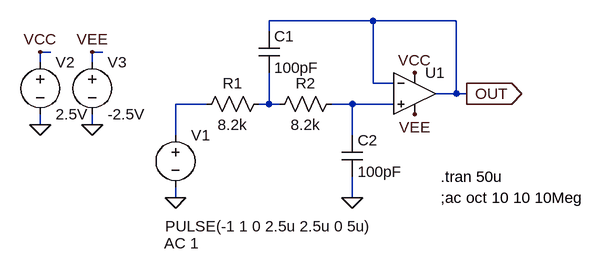
[diagram p0: schematic 2nd VCVS.asc]
2nd VCVS.asc, the LTspice schematic file:
Version 4
SHEET 1 880 680
WIRE 80 -16 -80 -16
WIRE 208 -16 80 -16
WIRE -80 0 -80 -16
WIRE -416 32 -432 32
WIRE -336 32 -352 32
WIRE -432 48 -432 32
WIRE -352 48 -352 32
WIRE 80 80 80 -16
WIRE 112 80 80 80
WIRE 208 96 208 -16
WIRE 208 96 176 96
WIRE 224 96 208 96
WIRE -176 112 -224 112
WIRE -80 112 -80 64
WIRE -80 112 -96 112
WIRE -64 112 -80 112
WIRE 48 112 16 112
WIRE 112 112 48 112
WIRE -432 144 -432 128
WIRE -352 144 -352 128
WIRE -224 160 -224 112
WIRE 48 160 48 112
WIRE -224 256 -224 240
WIRE 48 256 48 224
FLAG -224 256 0
FLAG 48 256 0
FLAG -432 144 0
FLAG -352 144 0
FLAG -432 32 VCC
FLAG -352 32 VEE
FLAG 144 64 VCC
FLAG 144 128 VEE
FLAG 224 96 OUT
IOPIN 224 96 Out
SYMBOL Opamps\\UniversalOpamp2 144 96 R0
SYMATTR InstName U1
SYMBOL res -80 96 R90
WINDOW 0 0 56 VBottom 2
WINDOW 3 32 56 VTop 2
SYMATTR InstName R1
SYMATTR Value 8.2k
SYMBOL res 32 96 R90
WINDOW 0 0 56 VBottom 2
WINDOW 3 32 56 VTop 2
SYMATTR InstName R2
SYMATTR Value 8.2k
SYMBOL cap -96 0 R0
SYMATTR InstName C1
SYMATTR Value 100pF
SYMBOL cap 32 160 R0
SYMATTR InstName C2
SYMATTR Value 100pF
SYMBOL voltage -224 144 R0
WINDOW 123 -17 182 Left 2
WINDOW 39 0 0 Left 2
WINDOW 3 -16 156 Left 2
SYMATTR Value2 AC 1
SYMATTR Value PULSE(-1 1 0 2.5u 2.5u 0 5u)
SYMATTR InstName V1
SYMBOL voltage -432 32 R0
WINDOW 123 0 0 Left 2
WINDOW 39 0 0 Left 2
SYMATTR InstName V2
SYMATTR Value 2.5V
SYMBOL voltage -352 32 R0
WINDOW 123 0 0 Left 2
WINDOW 39 0 0 Left 2
SYMATTR InstName V3
SYMATTR Value -2.5V
TEXT 184 224 Left 2 !.tran 50u
TEXT 184 256 Left 2 !;ac oct 10 10 10Meg

The netlist it stands for:
* 2nd VCVS.asc
XU1 N003 OUT VCC VEE OUT level.2 Avol=1Meg GBW=10Meg Slew=10Meg ilimit=25m rail=0 Vos=0 phimargin=45 en=0 enk=0 in=0 ink=0 Rin=500Meg  ; pins IN+ IN- V+ V- OUT
R1 N002 N001 8.2k
R2 N003 N002 8.2k
C1 OUT N002 100pF
C2 N003 0 100pF
V1 N001 0 PULSE(-1 1 0 2.5u 2.5u 0 5u) AC 1
V2 VCC 0 2.5V
V3 VEE 0 -2.5V
.tran 50u
;ac oct 10 10 10Meg
.lib UniversalOpamps2.sub
.backanno
.end